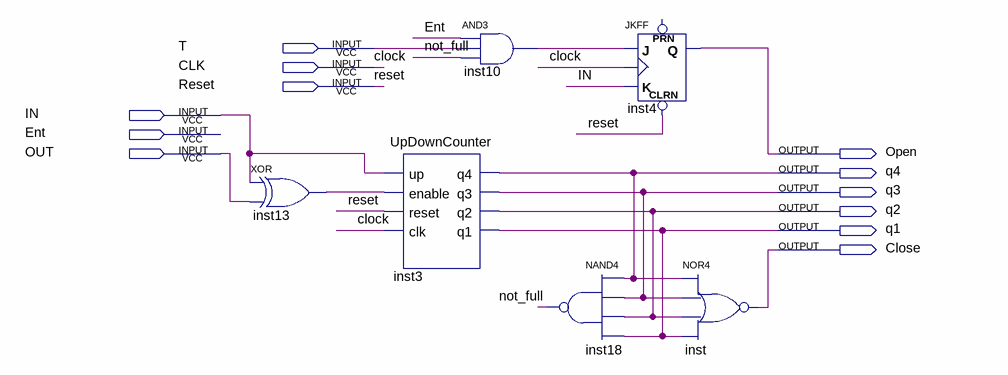
[diagram p0: schematic sheet]
// Quartus schematic Project2.bdf as structural Verilog: 6 symbols, 12 pins
module Project2 (
  input  T,
  input  CLK,
  input  Reset,
  input  IN,
  input  Ent,
  input  OUT,
  output Open,
  output q4,
  output q3,
  output q2,
  output q1,
  output Close
);

  wire inst10_out, inst13_out, not_full;

  xor inst13 (inst13_out, IN, OUT);
  UpDownCounter inst3 (.up(IN), .enable(inst13_out), .reset(Reset), .clk(CLK), .q4(q4), .q3(q3), .q2(q2), .q1(q1));
  and inst10 (inst10_out, Ent, T, not_full);
  nand inst18 (not_full, q4, q3, q2, q1);
  JKFF inst4 (.CLRN(Reset), .K(IN), .J(inst10_out), .CLK(CLK), .Q(Open));  // open: PRN
  nor inst (Close, q4, q3, q2, q1);

  // Other names for the same wires on the sheet: clock = CLK
endmodule
